# EAGLE design EMB1061 (EAGLE 9.6.2)
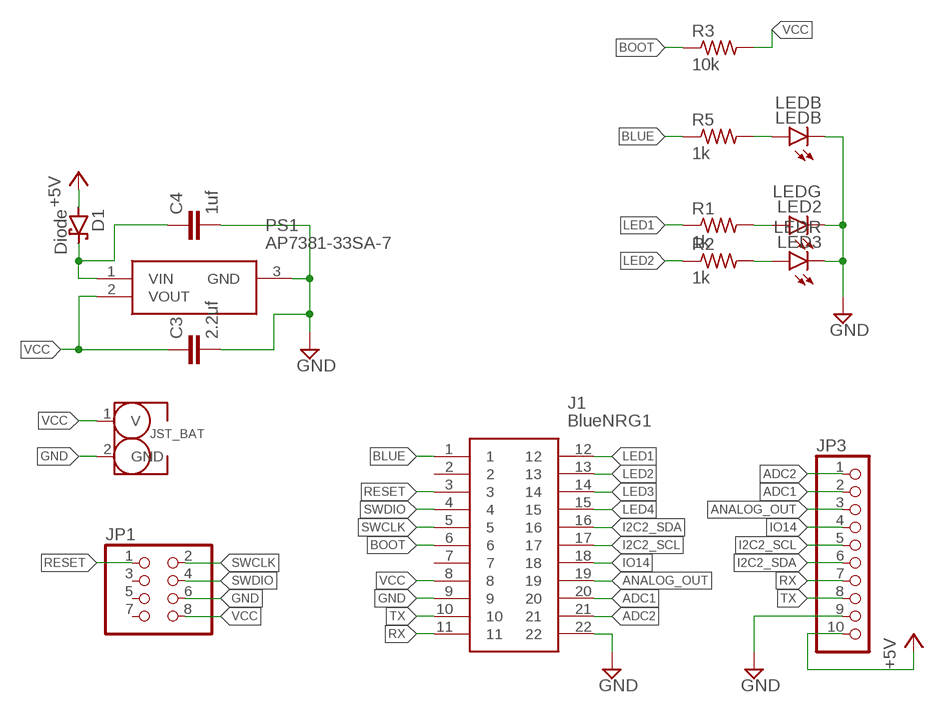
[diagram p0: schematic, sheet 1]

## Parts
C3  2.2uf  C-EUC0603K  [C0603K]
C4  1uf  C-EUC0603K  [C0603K]
D1  Diode  BAT60J  [SOD323_ST]
J1  BlueNRG1  113990637  [113990637]
JP1  PINHD-2X4  [2X04]
JP3  PINHD-1X10  [1X10]
LED2  LEDG  LEDSML0805  [SML0805]
LED3  LEDR  LEDSML0805  [SML0805]
LEDB  LEDB  LEDSML0805  [SML0805]
PS1  AP7381-33SA-7  [SOT96P240X120-3N]
R1  1k  R-US_R0805  [R0805]
R2  1k  R-US_R0805  [R0805]
R3  10k  R-US_R0603  [R0603]
R5  1k  R-US_R0805  [R0805]
U$1  JST2.0MM_2PIN  [JST2.0MM_2PIN]

## Nets
+5V: D1.A JP3.10
ADC1: J1.20 JP3.2
ADC2: J1.21 JP3.1
ANALOG_OUT: J1.19 JP3.3
BLUE: J1.1 R5.1
BOOT: J1.6 R3.1
GND: C3.2 C4.2 J1.9 J1.22 JP1.6 JP3.9 LED2.C LED3.C LEDB.C PS1.3(GND) U$1.2(GND)
I2C2_SCL: J1.17 JP3.5
I2C2_SDA: J1.16 JP3.6
IO14: J1.18 JP3.4
LED1: J1.12 R1.1
LED2: J1.13 R2.1
LED3: J1.14
LED4: J1.15
N$1: LEDB.A R5.2
N$20: LED2.A R1.2
N$21: LED3.A R2.2
RESET: J1.3 JP1.1
RX: J1.11 JP3.7
SWCLK: J1.5 JP1.2
SWDIO: J1.4 JP1.4
TX: J1.10 JP3.8
VCC: C3.1 J1.8 JP1.8 PS1.2(VOUT) R3.2 U$1.1(V)
VIN: C4.1 D1.C PS1.1(VIN)
Unconnected: J1.2 J1.7 JP1.3 JP1.5 JP1.7

## Library data of the parts
C3 C4 = rcl:C-EU: CAPACITOR, European symbol; SPICEPREFIX: C
D1 = diode:BAT60J: Schottky barrier diode Source: www.st.com, BAT60J.pdf
J1 = SamacSys_Parts:113990637: Bluetooth v4.2 (BLE) 3.3V 22-Pin Source: Datasheet <http://www.mxchip.com/download/getFiles/5c04f763667b4.pdf>; DESCRIPTION: Bluetooth v4.2 (BLE) 3.3V 22-Pin; HEIGHT: 4mm; MANUFACTURER_NAME: Seeed Studio; MANUFACTURER_PART_NUMBER: 113990637; MOUSER_PART_NUMBER: 713-113990637; MOUSER_PRICE-STOCK: https://www.mouser.co.uk/ProductDetail/Seeed-Studio/113990637?qs=gZXFycFWdAMlTq%252B0pAB4jw%3D%3D
JP1 = pinhead:PINHD-2X4: PIN HEADER
JP3 = pinhead:PINHD-1X10: PIN HEADER
LED2 LED3 LEDB = led:LED: LED OSRAM: - CHIPLED LG R971, LG N971, LY N971, LG Q971, LY Q971, LO R971, LY R971 LH N974, LH R974 LS Q976, LO Q976, LY Q976 LO Q996 - Hyper CHIPLED LW Q18S LB Q993, LB Q99A, LB R99A - SideLED LS A670, LO A670, LY A670, LG A670, LP A670 LB A673, LV A673, LT A673, LW A673 LH A674 LY A675 LS A676, LA A676, LO A676, LY A676, LW A676 LS A679, LY A679, LG A679 - Hyper Micro SIDELED® LS Y876, LA Y876, LO Y876, LY Y876 LT Y87S - SmartLED LW L88C, LW L88S LB L89C, LB L89S, LG L890 LS L89K, LO L89K, LY L89K LS L896, LA L896, LO L896, LY L896 - TOPLED LS T670, LO T670, LY T670, LG T670, LP T670 LSG T670, LSP T670, LSY T670, LOP T670, LYG T670 LG T671, LOG T671, LSG T671 LB T673, LV T673, LT T673, LW T673 LH T674 LS T676, LA T676, LO T676, LY T676, LB T676, LH T676, LSB T676, LW T676 LB T67C, LV T67C, LT T67C, LS T67K, LO T67K, LY T67K, LW E67C LS E67B, LA E67B, LO E67B, LY E67B, LB E67C, LV E67C, LT E67C LW T67C LS T679, LY T679, LG T679 LS T770, LO T770, LY T770, LG T770, LP T770 LB T773, LV T773, LT T773, LW T773 LH T774 LS E675, LA E675, LY E675, LS T675 LS T776, LA T776, LO T776, LY T776, LB T776 LHGB T686 LT T68C, LB T68C - Hyper Mini TOPLED® LB M676 - Mini TOPLED Santana® LG M470 LS M47K, LO M47K, LY M47K Source: http://www.osram.convergy.de LUXEON: - LUMILED® LXK2-PW12-R00, LXK2-PW12-S00, LXK2-PW14-U00, LXK2-PW14-V00 LXK2-PM12-R00, LXK2-PM12-S00, LXK2-PM14-U00 LXK2-PE12-Q00, LXK2-PE12-R00, LXK2-PE12-S00, LXK2-PE14-T00, LXK2-PE14-U00 LXK2-PB12-K00, LXK2-PB12-L00, LXK2-PB12-M00, LXK2-PB14-N00, LXK2-PB14-P00, LXK2-PB14-Q00 LXK2-PR12-L00, LXK2-PR12-M00, LXK2-PR14-Q00, LXK2-PR14-R00 LXK2-PD12-Q00, LXK2-PD12-R00, LXK2-PD12-S00 LXK2-PH12-R00, LXK2-PH12-S00 LXK2-PL12-P00, LXK2-PL12-Q00, LXK2-PL12-R00 Source: www.luxeon.com KINGBRIGHT: KA-3528ASYC Source: www.kingbright.com
PS1 = mouser-3.3v_AP7381-33SA-7:AP7381-33SA-7: LDO CMOS LowCurr SOT23 T&R 3K Source: Datasheet <https://www.diodes.com/assets/Datasheets/AP7381.pdf>; DESCRIPTION: LDO CMOS LowCurr SOT23 T&R 3K; HEIGHT: 1.2mm; MANUFACTURER_NAME: Diodes Inc.; MANUFACTURER_PART_NUMBER: AP7381-33SA-7; MOUSER_PART_NUMBER: 621-AP7381-33SA-7; MOUSER_PRICE-STOCK: https://www.mouser.co.uk/ProductDetail/Diodes-Incorporated/AP7381-33SA-7?qs=y6ZabgHbY%252ByfboEZm%252BnPlA%3D%3D
R1-R3 R5 = rcl:R-US_: RESISTOR, American symbol; SPICEPREFIX: R
U$1 = Gil:JST2.0MM_2PIN

## Board
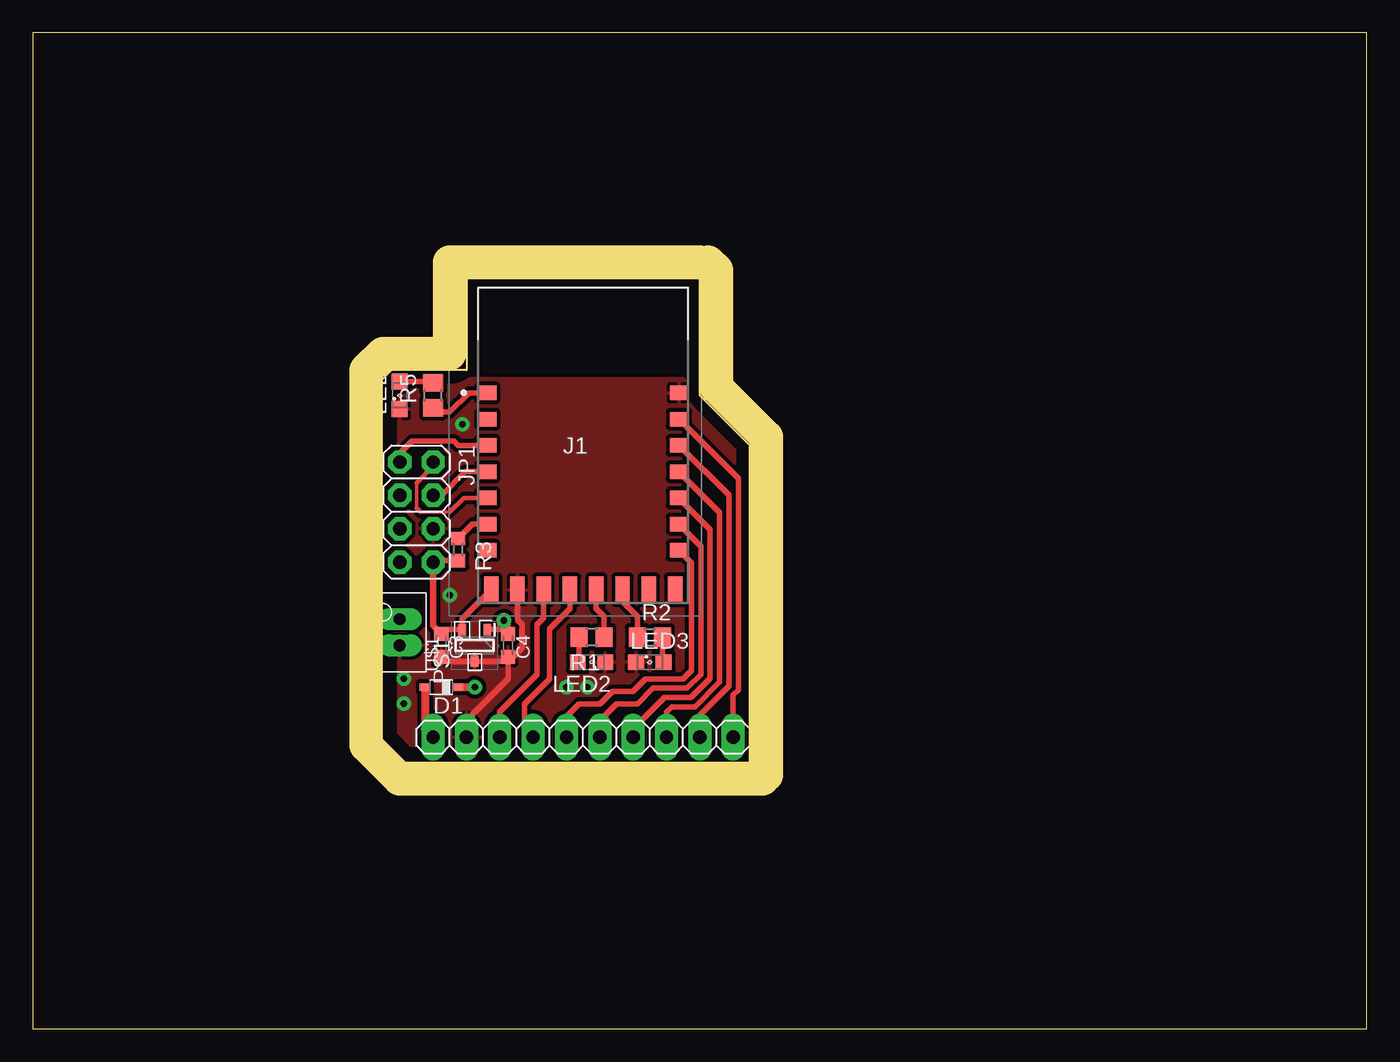
[diagram p1: board, top side]
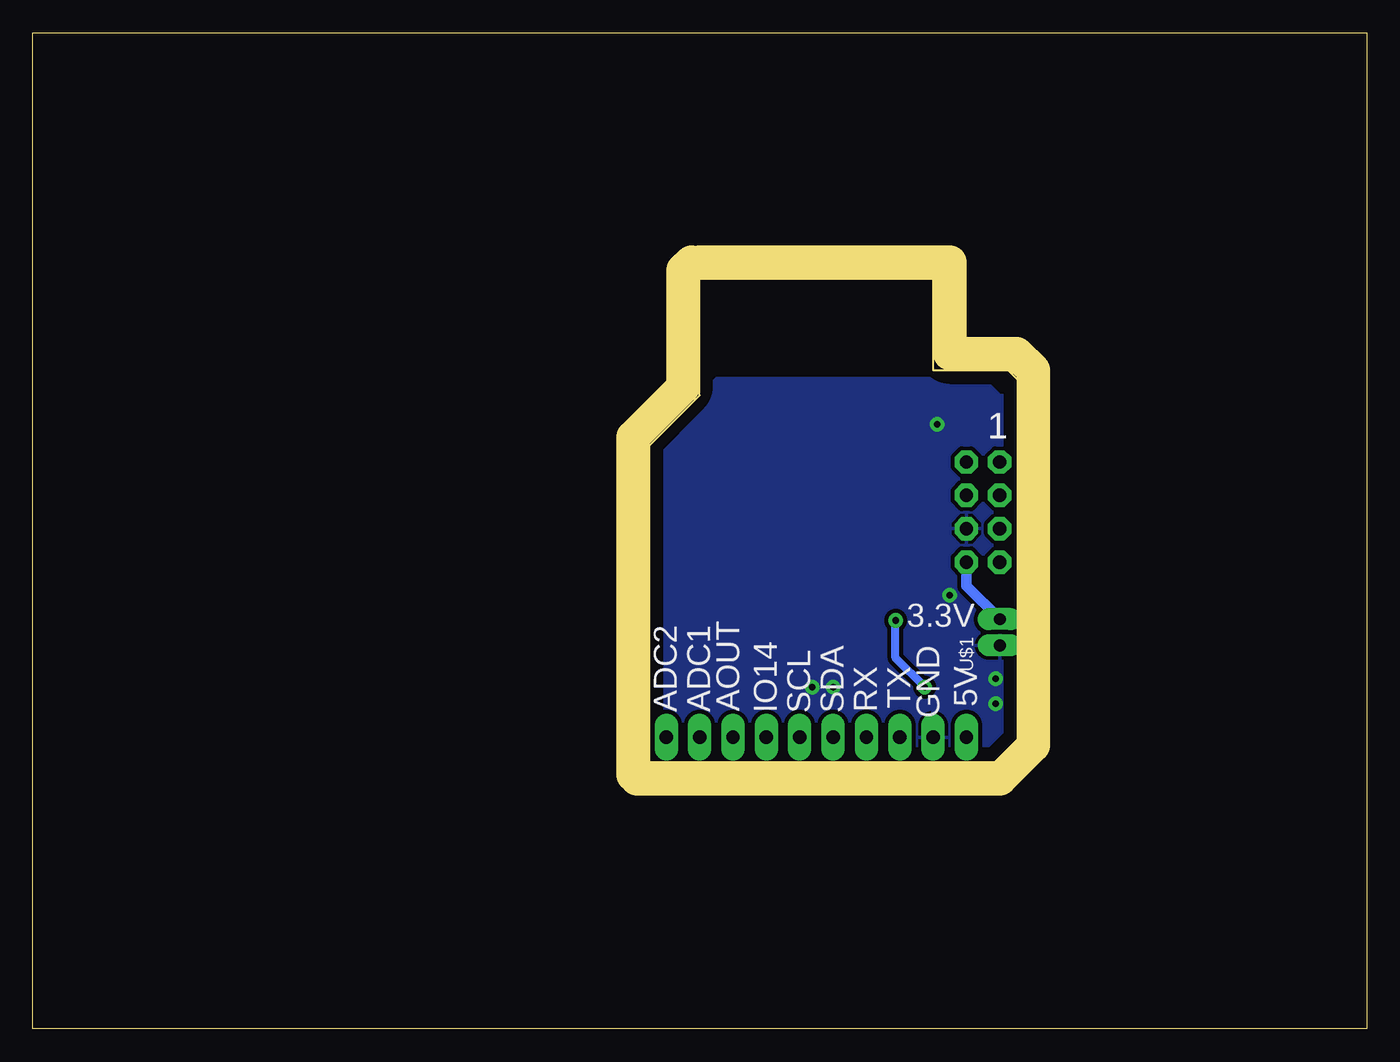
[diagram p2: board, bottom side, seen from below]

Size 101.58 x 75.87 mm. Coordinates in mm from the lower left corner, seen from the top.
Outline: 50.8,58.42 31.75,58.42 31.75,51.44 26.67,51.44 25.4,50.16 25.4,21.59 27.94,19.05 55.56,19.05 55.88,19.37 55.88,45.09 52.07,48.9 52.07,57.78 51.44,58.42
Outline: 0,0 101.58,0 101.58,75.87 0,75.87 0,0
Copper layers (1*16): Top 0.035mm / dielectric 1.5mm / Bottom 0.035mm
Design rules "default *": minimum track width 6mil, minimum drill 0.35mm, track to track 12mil, track to pad 12mil, pad to pad 6mil, via to via 6mil, smd to smd 6mil, copper to edge 40mil, drill to drill 6mil, minimum pad ring 15mil, minimum via ring 12mil, stop-mask expansion 4mil, vias tented up to drill 0mil, thermal gap 10mil
Milling: 10 lines

### Footprints (pad centres in the part's own frame; a part is rotated, then mirrored left to right if it is on the bottom)
C0603K = smd 1.05 x 1.08: 1 -0.875,0; 2 0.875,0
SOD323_ST = smd 0.8 x 0.6: A 1.25,0; C -1.25,0
113990637 = smd 1.4 x 1.1: 1 -7.3,4; 2 -7.3,2; 3 -7.3,0; 4 -7.3,-2; 5 -7.3,-4; 6 -7.3,-6; 7 -7.3,-8; 16 7.3,-8; 17 7.3,-6; 18 7.3,-4; 19 7.3,-2; 20 7.3,0; 21 7.3,2; 22 7.3,4 | smd 1.1 x 2: 8 -7,-11; 9 -5,-11; 10 -3,-11; 11 -1,-11; 12 1,-11; 13 3,-11; 14 5,-11; 15 7,-11
2X04 = drill 1.016 octagon: 1 -3.81,-1.27; 2 -3.81,1.27; 3 -1.27,-1.27; 4 -1.27,1.27; 5 1.27,-1.27; 6 1.27,1.27; 7 3.81,-1.27; 8 3.81,1.27
1X10 = drill 1.016 long: 1 -11.43,0; 2 -8.89,0; 3 -6.35,0; 4 -3.81,0; 5 -1.27,0; 6 1.27,0; 7 3.81,0; 8 6.35,0; 9 8.89,0; 10 11.43,0
SML0805 = smd 1.2 x 1.2: A 1.05,0; C -1.05,0
SOT96P240X120-3N = smd 0.85 x 0.6: 1 -1.2,0.96; 2 -1.2,-0.96; 3 1.2,0
R0805 = smd 1.3 x 1.5: 1 -0.95,0; 2 0.95,0
R0603 = smd 1 x 1.1: 1 -0.85,0; 2 0.85,0
JST2.0MM_2PIN = drill 0.9 pad 1.27 long: 1 0,2; 2 0,0

### Placement (x,y rotation side)
C3  31.11,29.21 270 top
C4  36.2,29.21 270 top
D1  31.11,26.04 180 top
J1  41.91,44.45 0 top
JP1  29.21,39.37 270 top
JP3  41.91,22.23 180 top
LED2  42.55,27.94 180 top
LED3  46.99,27.94 0 top
LEDB  27.94,48.26 90 top
PS1  33.66,29.21 270 top
R1  42.55,29.84 180 top
R2  46.99,29.84 0 top
R3  32.38,36.51 270 top
R5  30.48,48.26 90 top
U$1  27.94,29.21 0 top

### Tracks (layer width: path | path; a pad name or v marks a point on that pad's centre or on a via)
+5V
  Top 0.61: D1.A 29.86,22.84 JP3.10
ADC1
  Top 0.406: JP3.2 50.8,23.92 53.01,26.13 53.01,40.65 J1.20
ADC2
  Top 0.406: JP3.1 53.34,25.45 53.72,25.83 53.72,41.94 J1.21
ANALOG_OUT
  Top 0.406: J1.19 49.21,42.42 52.3,39.33 52.3,26.42 50.41,24.54 48.67,24.54 48.26,24.13 JP3.3
BLUE
  Top 0.406: J1.1 33.21,48.45 31.75,46.99 30.8,46.99 R5.1
BOOT
  Top 0.406: J1.6 33.47,38.45 R3.1
GND  (via drill 0.5)
  Top 0.406: JP3.9 33.02,23.5 36.2,26.67 36.2,27.94 | 36.2,27.94 C4.2 35.87,28.01 PS1.3 31.44,28.01 C3.2 | J1.9 36.91,31.15 37.24,30.82 37.24,28.99 36.2,27.94
  other vias: 32.7,46.04 40.64,26.04 28.26,26.67 28.26,24.77 31.75,33.02 42.23,26.04
  pour Bottom: 49.53,49.53 54.61,44.45 54.61,22.86 53.34,21.59 27.94,21.59 26.67,22.86 26.67,48.26 27.94,48.26 29.21,49.53
  pour Top: 49.53,49.53 54.61,44.45 54.61,21.59 26.67,21.59 26.67,48.26 27.94,49.53
I2C2_SCL
  Top 0.406: J1.17 49.21,38.42 50.88,36.75 50.88,27.01 49.83,25.96 47.23,25.96 46.04,24.77 44.45,24.77 43.18,23.5 JP3.5
I2C2_SDA
  Top 0.406: J1.16 50.16,35.49 50.16,27.3 49.53,26.67 46.67,26.67 45.72,25.72 44.13,25.72 43.18,24.77 41.59,24.77 40.64,23.81 JP3.6
IO14
  Top 0.406: J1.18 49.21,40.42 51.59,38.04 51.59,26.72 50.12,25.25 48.11,25.25 46.04,23.18 45.72,23.18 JP3.4
LED1
  Top 0.406: J1.12 42.91,32.02 43.49,31.43 R1.1
LED2
  Top 0.406: J1.13 44.91,32.56 46.04,31.43 R2.1
N$1
  Top 0.406: R5.2 30.38,49.31 LEDB.A
N$20
  Top 0.406: R1.2 41.59,28.04 LED2.A
N$21
  Top 0.406: R2.2 47.94,28.04 LED3.A
RESET
  Top 0.406: J1.3 32.38,44.45 32.07,44.77 28.89,44.77 27.94,43.81 JP1.1
RX
  Top 0.406: J1.11 40.91,32.02 39.37,30.48 39.37,26.67 37.47,24.77 37.47,22.86 JP3.7
SWCLK
  Top 0.254: 31.75,39.37 29.53,39.37 | 29.21,39.69 29.21,41.59
  Top 0.356: J1.5 32.83,40.45 31.75,39.37 | 29.53,39.37 29.21,39.69 | JP1.2 30.48,42.86 29.21,41.59
SWDIO
  Top 0.406: JP1.4 31.11,40.64 32.92,42.45 J1.4
TX
  Top 0.406: J1.10 38.91,31.29 38.42,30.8 38.42,26.99 35.56,24.13 JP3.8
VCC
  Top 0.406: C3.1 31.44,30.41 PS1.2 32.7,31.23 J1.8 | R3.2 30.58,35.66 JP1.8
  Top 0.508: C3.1 30.48,30.72 JP1.8
  Bottom 0.813: U$1.1 30.48,33.75 JP1.8
VIN  (via drill 0.5)
  Top 0.406: PS1.1 35.87,30.41 C4.1 36.2,30.8 v35.88,31.11
  Top 0.61: D1.C v33.66,26.04
  Bottom 0.61: v33.66,26.04 35.88,28.26 v35.88,31.11

### Text on the board
bNames: 1 | 3.3V | AOUT | ADC1 | ADC2 | IO14 | GND | SDA | SCL | 5V | TX | RX